# EAGLE schematic Pos_Vel_Circuit_Designed (EAGLE 9.6.2)
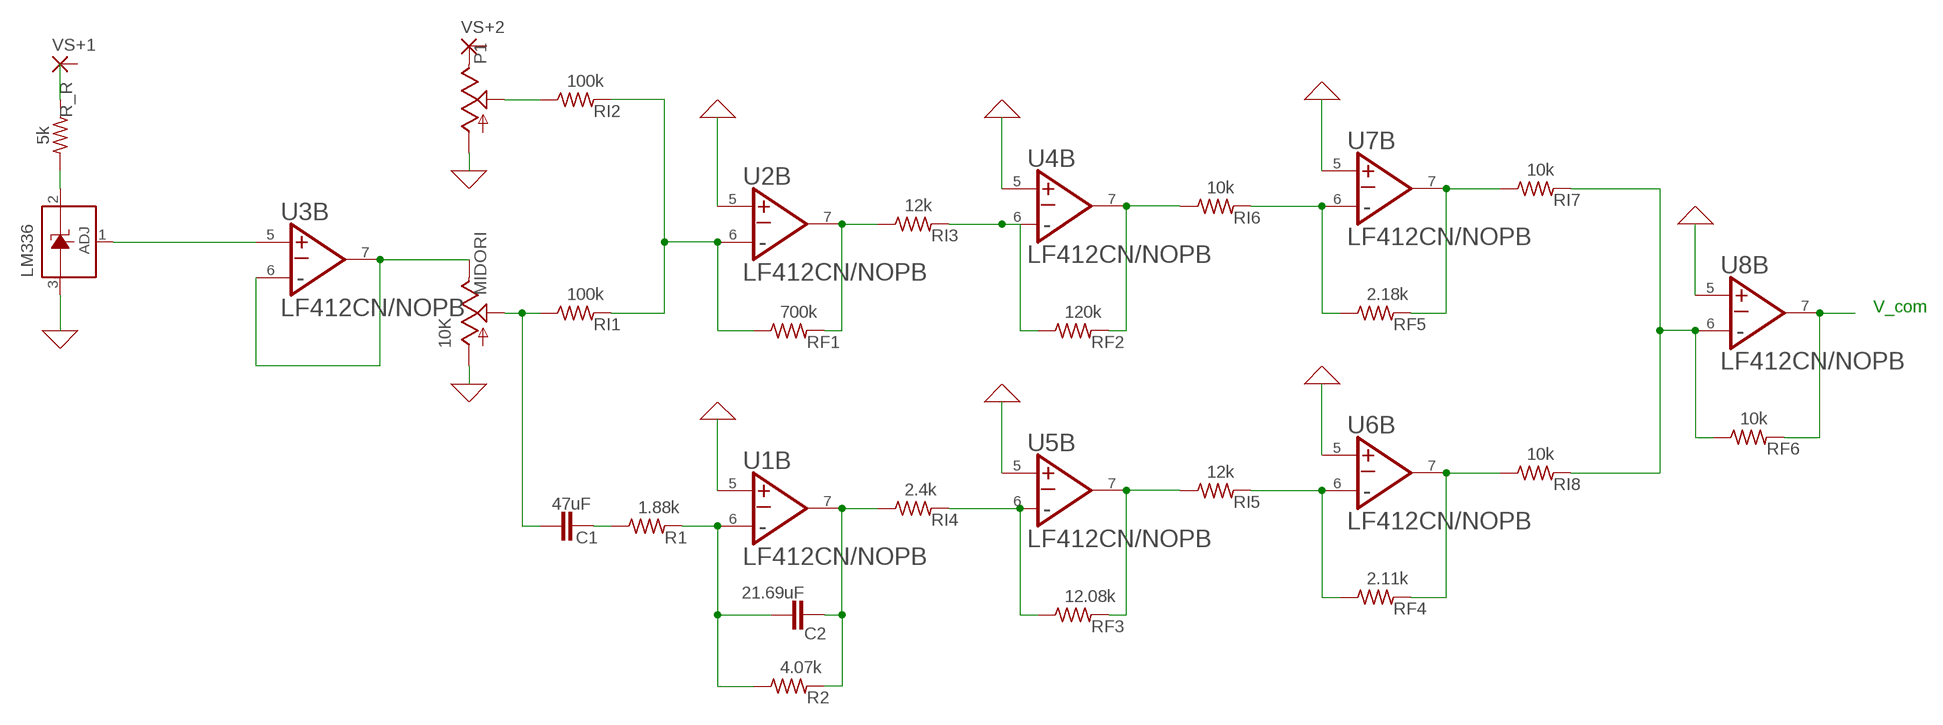
[diagram p0: schematic, sheet 1]

## Parts
C1  47uF  C2,5-3  [C2.5-3]
C2  21.69uF  C2,5-3  [C2.5-3]
LM336  LM336LP  [TO92]
MIDORI  10K  TRIM_US-CIP20C-4MM  [CIP20C-4MM]
P1  TRIM_US-CIP20C-4MM  [CIP20C-4MM]
R1  1.88k  R-US_0309/10  [0309/10]
R2  4.07k  R-US_0309/10  [0309/10]
R_R  5k  R-US_0309/10  [0309/10]
RF1  700k  R-US_0309/10  [0309/10]
RF2  120k  R-US_0309/10  [0309/10]
RF3  12.08k  R-US_0309/10  [0309/10]
RF4  2.11k  R-US_0309/10  [0309/10]
RF5  2.18k  R-US_0309/10  [0309/10]
RF6  10k  R-US_0309/10  [0309/10]
RI1  100k  R-US_0309/10  [0309/10]
RI2  100k  R-US_0309/10  [0309/10]
RI3  12k  R-US_0309/10  [0309/10]
RI4  2.4k  R-US_0309/10  [0309/10]
RI5  12k  R-US_0309/10  [0309/10]
RI6  10k  R-US_0309/10  [0309/10]
RI7  10k  R-US_0309/10  [0309/10]
RI8  10k  R-US_0309/10  [0309/10]
U1  TEXAS_INSTRUMENTS_LF412CN-NOPBTEXAS_INSTRUMENTS_LF412CN-NOPB_0_0  [TEXAS_INSTRUMENTS_LF412CN-NOPB_0]
U2  TEXAS_INSTRUMENTS_LF412CN-NOPBTEXAS_INSTRUMENTS_LF412CN-NOPB_0_0  [TEXAS_INSTRUMENTS_LF412CN-NOPB_0]
U3  TEXAS_INSTRUMENTS_LF412CN-NOPBTEXAS_INSTRUMENTS_LF412CN-NOPB_0_0  [TEXAS_INSTRUMENTS_LF412CN-NOPB_0]
U4  TEXAS_INSTRUMENTS_LF412CN-NOPBTEXAS_INSTRUMENTS_LF412CN-NOPB_0_0  [TEXAS_INSTRUMENTS_LF412CN-NOPB_0]
U5  TEXAS_INSTRUMENTS_LF412CN-NOPBTEXAS_INSTRUMENTS_LF412CN-NOPB_0_0  [TEXAS_INSTRUMENTS_LF412CN-NOPB_0]
U6  TEXAS_INSTRUMENTS_LF412CN-NOPBTEXAS_INSTRUMENTS_LF412CN-NOPB_0_0  [TEXAS_INSTRUMENTS_LF412CN-NOPB_0]
U7  TEXAS_INSTRUMENTS_LF412CN-NOPBTEXAS_INSTRUMENTS_LF412CN-NOPB_0_0  [TEXAS_INSTRUMENTS_LF412CN-NOPB_0]
U8  TEXAS_INSTRUMENTS_LF412CN-NOPBTEXAS_INSTRUMENTS_LF412CN-NOPB_0_0  [TEXAS_INSTRUMENTS_LF412CN-NOPB_0]
VS+1  1,6/0,8  [1,6/0,8]
VS+2  1,6/0,8  [1,6/0,8]

## Nets
0: LM336.3(A) MIDORI.A P1.A U1.5(B:NON-INVERTING_INPUT_B) U2.5(B:NON-INVERTING_INPUT_B) U4.5(B:NON-INVERTING_INPUT_B) U5.5(B:NON-INVERTING_INPUT_B) U6.5(B:NON-INVERTING_INPUT_B) U7.5(B:NON-INVERTING_INPUT_B) U8.5(B:NON-INVERTING_INPUT_B) ; supply symbol labelled GND
N$1: MIDORI.E U3.6(B:INVERTING_INPUT_B) U3.7(B:OUTPUT_B)
N$2: LM336.2(C) R_R.2
N$3: C1.1 MIDORI.S RI1.1
N$4: RF1.1 RI1.2 RI2.2 U2.6(B:INVERTING_INPUT_B)
N$5: P1.S RI2.1
N$6: R_R.1
N$7: RF1.2 RI3.1 U2.7(B:OUTPUT_B)
N$8: C1.2 R1.1
N$9: RF2.1 RI3.2 U4.6(B:INVERTING_INPUT_B)
N$10: RF2.2 U4.7(B:OUTPUT_B)
N$11: RF3.1 RI4.2 U5.6(B:INVERTING_INPUT_B)
N$12: RF3.2 RI5.1 U5.7(B:OUTPUT_B)
N$13: C2.1 R1.2 R2.1 U1.6(B:INVERTING_INPUT_B)
N$14: C2.2 R2.2 RI4.1 U1.7(B:OUTPUT_B)
N$15: RF4.1 RI5.2 U6.6(B:INVERTING_INPUT_B)
N$16: RF4.2 RI8.1 U6.7(B:OUTPUT_B)
N$17: RI6.1
N$18: RF5.1 RI6.2 U7.6(B:INVERTING_INPUT_B)
N$19: RF5.2 RI7.1 U7.7(B:OUTPUT_B)
N$20: RF6.1 RI7.2 RI8.2 U8.6(B:INVERTING_INPUT_B)
N$21: LM336.1(ADJ) U3.5(B:NON-INVERTING_INPUT_B)
N$23: RF6.2 U8.7(B:OUTPUT_B)
Unconnected: P1.E U1.1(A:OUTPUT_A) U1.2(A:INVERTING_INPUT_A) U1.3(A:NON-INVERTING_INPUT_A) U2.1(A:OUTPUT_A) U2.2(A:INVERTING_INPUT_A) U2.3(A:NON-INVERTING_INPUT_A) U3.1(A:OUTPUT_A) U3.2(A:INVERTING_INPUT_A) U3.3(A:NON-INVERTING_INPUT_A) U4.1(A:OUTPUT_A) U4.2(A:INVERTING_INPUT_A) U4.3(A:NON-INVERTING_INPUT_A) U5.1(A:OUTPUT_A) U5.2(A:INVERTING_INPUT_A) U5.3(A:NON-INVERTING_INPUT_A) U6.1(A:OUTPUT_A) U6.2(A:INVERTING_INPUT_A) U6.3(A:NON-INVERTING_INPUT_A) U7.1(A:OUTPUT_A) U7.2(A:INVERTING_INPUT_A) U7.3(A:NON-INVERTING_INPUT_A) U8.1(A:OUTPUT_A) U8.2(A:INVERTING_INPUT_A) U8.3(A:NON-INVERTING_INPUT_A) VS+1.1(P) VS+2.1(P)

## Notes on the sheet
- V_com

## Power pins joined to a net without a drawn wire
V+: U1.8(A:V+) U2.8(A:V+) U3.8(A:V+) U4.8(A:V+) U5.8(A:V+) U6.8(A:V+) U7.8(A:V+) U8.8(A:V+)
V-: U1.4(A:V-) U2.4(A:V-) U3.4(A:V-) U4.4(A:V-) U5.4(A:V-) U6.4(A:V-) U7.4(A:V-) U8.4(A:V-)

## Library data of the parts
C1 C2 = capacitor-wima:C: CAPACITOR naming: grid - package width
LM336 = linear:LM336: 2.5-V INTEGRATED REFERENCE CIRCUITS LM236 Source: http://focus.ti.com/lit/ds/symlink/lm336-2.5.pdf
MIDORI P1 = pot:TRIM_US-: POTENTIOMETER
R1 R2 R_R RF1-RF6 RI1-RI8 = rcl:R-US_: RESISTOR, American symbol; SPICEPREFIX: R
U1-U8 = NOPB:TEXAS_INSTRUMENTS_LF412CN-NOPB: Low Offset, Low Drift Dual JFET Input Operational Amplifier 8-PDIP 0 to 70; AUTOMOTIVE: No; CENTROID_NOT_SPECIFIED: No; DATASHEET: https://www.ti.com/lit/ds/symlink/lf412-n.pdf; DEVICE_CLASS_L1: Integrated Circuits (ICs); DEVICE_CLASS_L2: Linear ICs; DEVICE_CLASS_L3: Amplifiers - Op Amps; DIGIKEY_DESCRIPTION: IC OPAMP JFET 2 CIRCUIT 8DIP; DIGIKEY_PART_NUMBER: LF412CN/NOPB-ND; FOOTPRINT_PARAMETERS_0: {"fp_type":"DIP","params":{"N":{"nom":8,"long name":"Number of leads","min":null,"max":null,"short name":"N","type":"count"},"A":{"nom":false,"long name":"Height","min":false,"max":5080000,"short name":"A","type":"measurement"},"A1":{"nom":false,"long name":"Package clearance","min":510000,"max":false,"short name":"A1","type":"measurement"},"A2":{"nom":false,"long name":"Package height","min":false,"max":4570000,"short name":"A2","type":"measurement"},"D":{"nom":false,"long name":"Package length","min":false,"max":10160000,"short name":"D","type":"measurement"},"E":{"nom":false,"long name":"Width w/ leads","min":7620000,"max":8260000,"short name":"E","type":"measurement"},"E1":{"nom":false,"long name":"Package width","min":false,"max":6600000,"short name":"E1","type":"measurement"},"B":{"nom":false,"long name":"Lead width","min":380000,"max":530000,"short name":"B","type":"measurement"},"C":{"nom":250000,"long name":"Lead thickness","min":false,"max":false,"short name":"C","type":"measurement"},"e":{"nom":2540000,"long name":"Lead pitch","min":null,"max":null,"short name":"e","type":"measurement"},"offset x":{"nom":0,"long name":"X Center offset","min":null,"max":null,"short name":"offset x","type":"measurement"},"offset y":{"nom":0,"long name":"Y Center offset","min":null,"max":null,"short name":"offset y","type":"measurement"},"LS":{"default":"Circle","long name":"Land shape","type":"multichoice","short name":"LS"},"LS1":{"default":"Square","long name":"Land shape (Pin 1)","type":"multichoice","short name":"LS1"}}}; FOOTPRINT_VARIANT_NAME_0: Recommended_Land_Pattern; GAIN_BANDWIDTH: 4MHz; HEIGHT: 5.08mm; INPUT_BIAS_CURRENT: 0.00005uA; INPUT_OFFSET_VOLTAGE: 1mV; LEAD_FREE: Yes; MAX_DUAL_SUPPLY_VOLTAGE: 15V; MAX_JUNCTION_TEMP: +115°C; MF: Texas Instruments; MFG_PACKAGE_IDENT: P0008A; MFG_PACKAGE_IDENT_COMPONENT_ID: 14e3c34b0210167e; MFG_PACKAGE_IDENT_DATE: 0; MFG_PACKAGE_IDENT_REV: 0; MOUSER_DESCRIPTION: Operational Amplifiers - Op Amps LOW OFFSET,LOW DRIFT DUAL JFET INP OP AMP; MOUSER_PART_NUMBER: 926-LF412CN/NOPB; MPN: LF412CN/NOPB; NOMINAL_SUPPLY_CURRENT: 3.6mA; NUMBER_OF_CHANNELS: 2; PACKAGE: PDIP8; PREFIX: U; ROHS: Yes; STANDOFF_HEIGHT: 0.51mm; TEMPERATURE_RANGE_HIGH: +70°C; TEMPERATURE_RANGE_LOW: 0°C; VERIFICATION_VERSION: 0.0.0.3; VOLTAGE_GAIN: 200V/mV
VS+1 VS+2 = wirepad:1,6/0,8: THROUGH-HOLE PAD